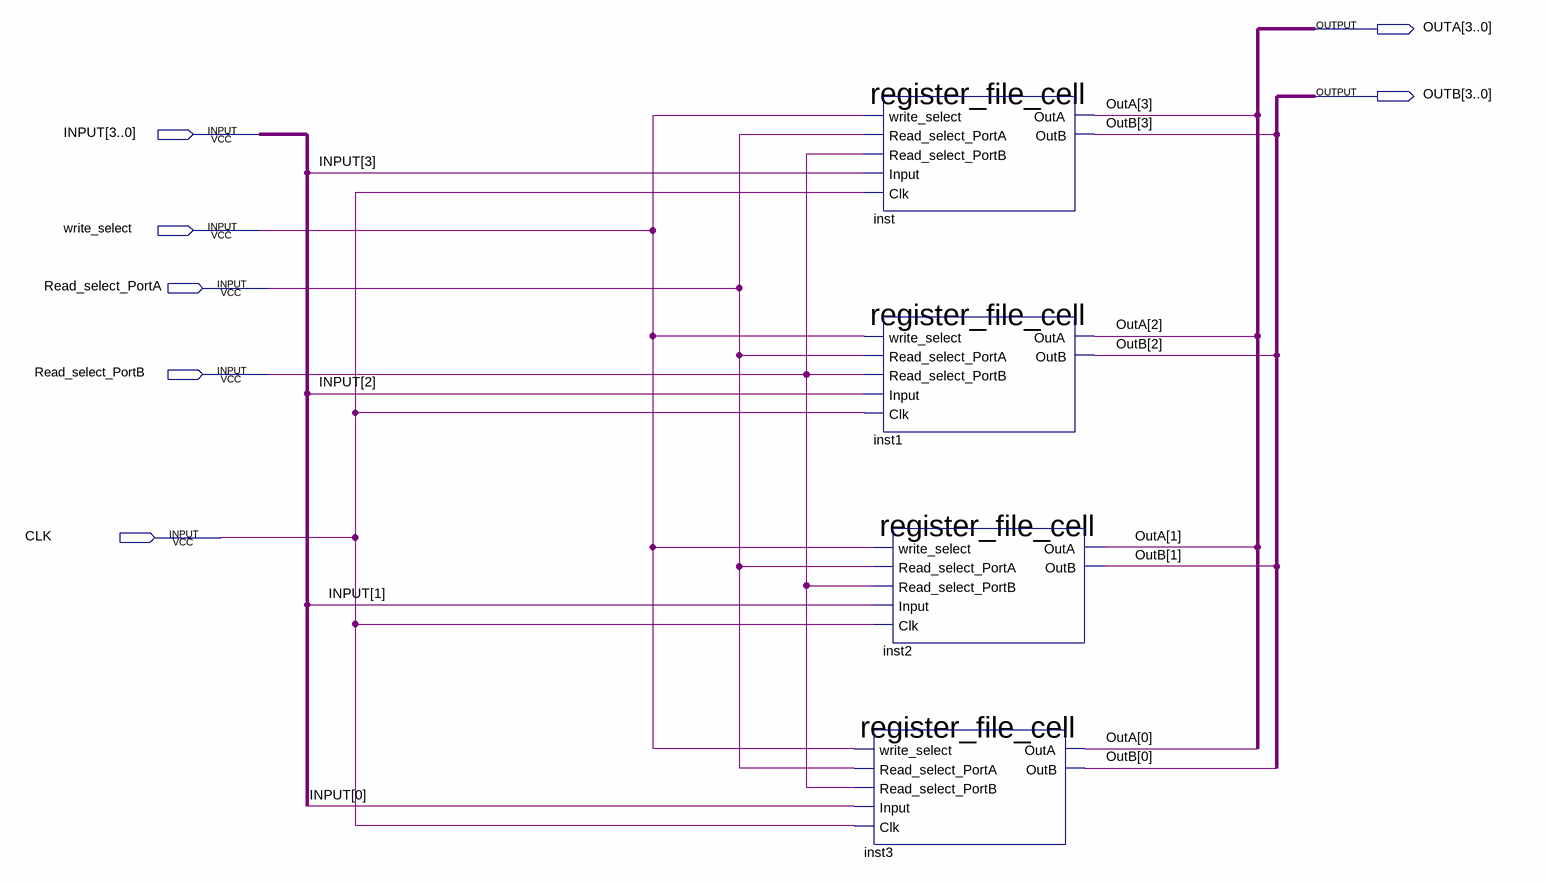
[diagram p0: schematic sheet]
// Quartus schematic 4BIT_RAM_CELL.bdf as structural Verilog: 4 symbols, 7 pins
module \4BIT_RAM_CELL  (
  input  [3:0] INPUT,
  input  write_select,
  input  Read_select_PortA,
  input  Read_select_PortB,
  input  CLK,
  output [3:0] OUTA,
  output [3:0] OUTB
);

  register_file_cell inst (
    .write_select(write_select), .Read_select_PortA(Read_select_PortA),
    .Read_select_PortB(Read_select_PortB), .Input(INPUT[3]), .Clk(CLK), .OutA(OUTA[3]), .OutB(OUTB[3]));
  register_file_cell inst1 (
    .write_select(write_select), .Read_select_PortA(Read_select_PortA),
    .Read_select_PortB(Read_select_PortB), .Input(INPUT[2]), .Clk(CLK), .OutA(OUTA[2]), .OutB(OUTB[2]));
  register_file_cell inst2 (
    .write_select(write_select), .Read_select_PortA(Read_select_PortA),
    .Read_select_PortB(Read_select_PortB), .Input(INPUT[1]), .Clk(CLK), .OutA(OUTA[1]), .OutB(OUTB[1]));
  register_file_cell inst3 (
    .write_select(write_select), .Read_select_PortA(Read_select_PortA),
    .Read_select_PortB(Read_select_PortB), .Input(INPUT[0]), .Clk(CLK), .OutA(OUTA[0]), .OutB(OUTB[0]));
endmodule
